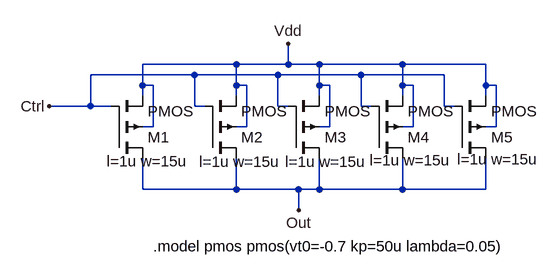
[diagram p0: schematic pass_element.asc]
pass_element.asc, the LTspice schematic file:
Version 4
SHEET 1 880 680
WIRE 256 48 112 48
WIRE 336 48 336 16
WIRE 336 48 256 48
WIRE 384 48 336 48
WIRE 512 48 384 48
WIRE 640 48 512 48
WIRE 192 64 32 64
WIRE 320 64 192 64
WIRE 448 64 320 64
WIRE 576 64 448 64
WIRE 112 80 112 48
WIRE 128 80 112 80
WIRE 256 80 256 48
WIRE 272 80 256 80
WIRE 384 80 384 48
WIRE 400 80 384 80
WIRE 512 80 512 48
WIRE 528 80 512 80
WIRE 640 80 640 48
WIRE 656 80 640 80
WIRE 112 96 112 80
WIRE 256 96 256 80
WIRE 384 96 384 80
WIRE 512 96 512 80
WIRE 640 96 640 80
WIRE 32 112 32 64
WIRE 32 112 -32 112
WIRE 64 112 32 112
WIRE 192 112 192 64
WIRE 208 112 192 112
WIRE 320 112 320 64
WIRE 336 112 320 112
WIRE 448 112 448 64
WIRE 464 112 448 112
WIRE 576 112 576 64
WIRE 592 112 576 112
WIRE 128 144 128 80
WIRE 128 144 112 144
WIRE 272 144 272 80
WIRE 272 144 256 144
WIRE 400 144 400 80
WIRE 400 144 384 144
WIRE 528 144 528 80
WIRE 528 144 512 144
WIRE 656 144 656 80
WIRE 656 144 640 144
WIRE 112 240 112 192
WIRE 256 240 256 192
WIRE 256 240 112 240
WIRE 352 240 256 240
WIRE 384 240 384 192
WIRE 384 240 352 240
WIRE 512 240 512 192
WIRE 512 240 384 240
WIRE 640 240 640 192
WIRE 640 240 512 240
WIRE 352 272 352 240
FLAG 336 16 Vdd
FLAG 352 272 Out
FLAG -32 112 Ctrl
SYMBOL pmos4 64 192 M180
WINDOW 123 -7 -5 Left 2
SYMATTR Value2 l=1u w=15u
SYMATTR InstName M1
SYMBOL pmos4 208 192 M180
WINDOW 123 -9 -6 Left 2
SYMATTR Value2 l=1u w=15u
SYMATTR InstName M2
SYMBOL pmos4 336 192 M180
WINDOW 123 -5 -6 Left 2
SYMATTR Value2 l=1u w=15u
SYMATTR InstName M3
SYMBOL pmos4 464 192 M180
WINDOW 123 -3 -3 Left 2
SYMATTR Value2 l=1u w=15u
SYMATTR InstName M4
SYMBOL pmos4 592 192 M180
WINDOW 123 4 -2 Left 2
SYMATTR Value2 l=1u w=15u
SYMATTR InstName M5
TEXT 128 328 Left 2 !.model pmos pmos(vt0=-0.7 kp=50u lambda=0.05)

The netlist it stands for:
* pass_element.asc
M1 Out Ctrl Vdd Vdd PMOS l=1u w=15u
M2 Out Ctrl Vdd Vdd PMOS l=1u w=15u
M3 Out Ctrl Vdd Vdd PMOS l=1u w=15u
M4 Out Ctrl Vdd Vdd PMOS l=1u w=15u
M5 Out Ctrl Vdd Vdd PMOS l=1u w=15u
.model NMOS NMOS
.model PMOS PMOS
.lib standard.mos
.model pmos pmos(vt0=-0.7 kp=50u lambda=0.05)
.backanno
.end